# Altium schematic sheet Functional_Schematic_v1.SchDoc
size 297 x 209 mm; SheetNumber: 2; SheetTotal: 2
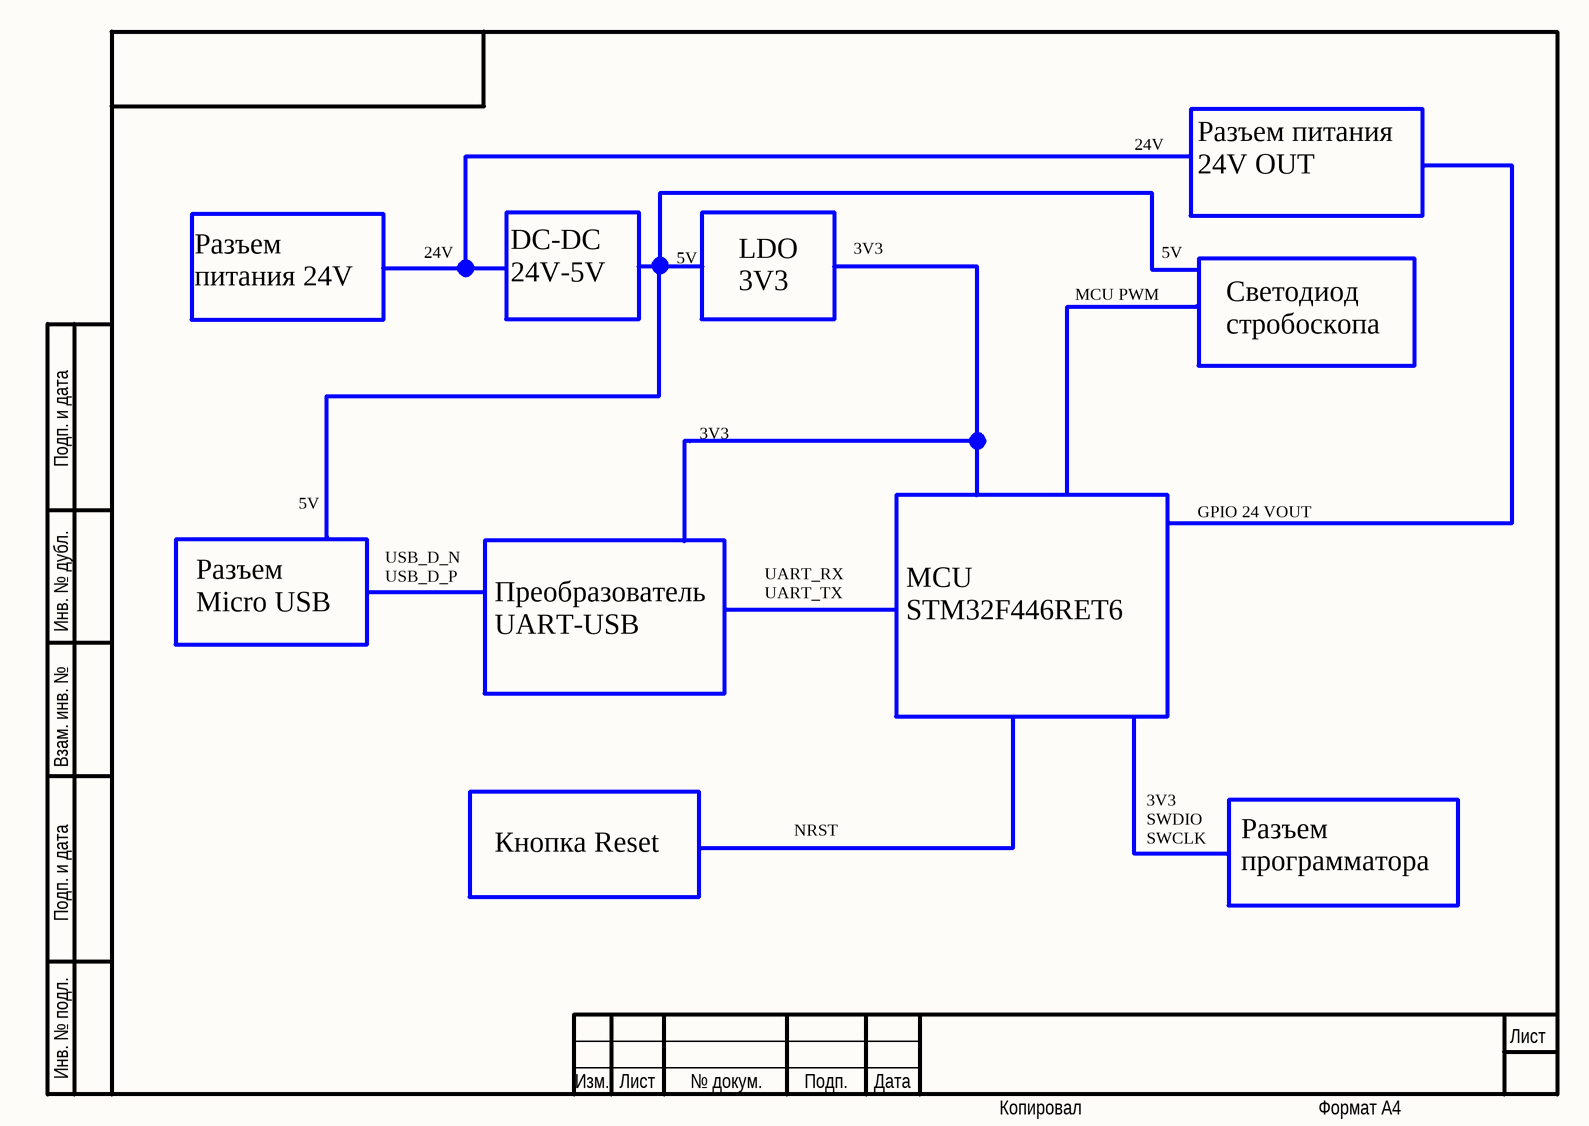
[diagram p0: Functional_Schematic_v1.SchDoc]

## Notes on the sheet
- 24V
- Разъем питания 24V OUT
- 5V
- 3V3
- Разъем питания 24V
- DC-DC 24V-5V
- LDO 3V3
- MCU PWM
- Светодиод стробоскопа
- GPIO 24 VOUT
- Разъем Micro USB
- USB_D_N
  USB_D_P
- Преобразователь UART-USB
- UART_RX
  UART_TX
- MCU
  STM32F446RET6
- NRST
- 3V3
  SWDIO
  SWCLK
- Кнопка Reset
- Разъем программатора
- Подп. и дата
- Инв. № дубл.
- Взам. инв. №
- Инв. № подл.
- Изм.
- Лист
- № докум.
- Подп.
- Дата
- Копировал
- Формат А4